# EAGLE schematic controller_rev4.2 (EAGLE 9.3.0)

## Sheet 1 of 3: Controller
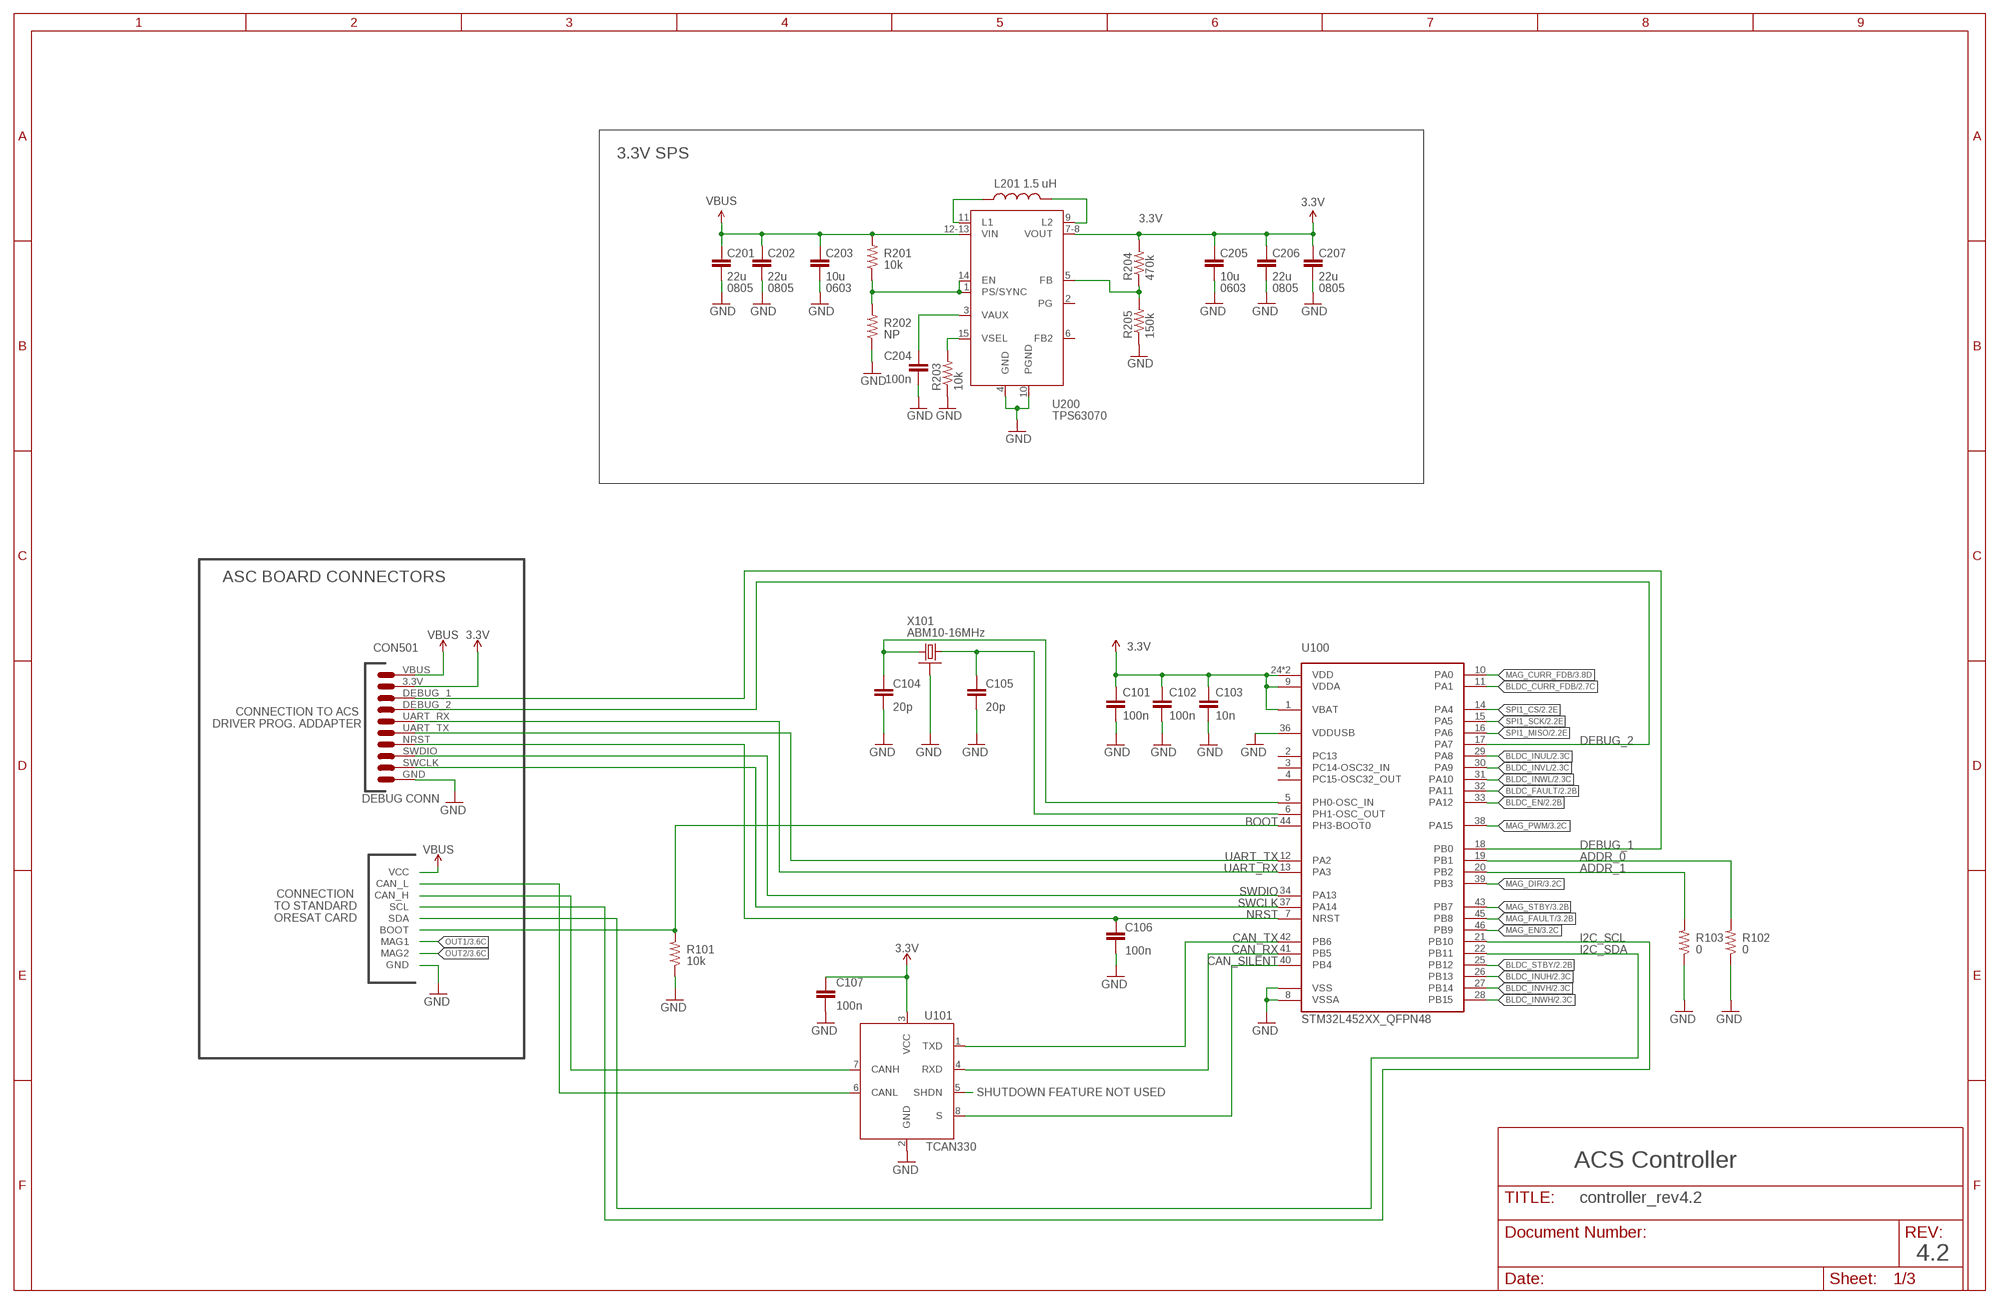
[diagram p0: schematic, sheet 1]

### Parts
C101  100n  C-EU0402-B-NOSILK  [.0402-B-NOSILK]
C102  100n  C-EU0402-B-NOSILK  [.0402-B-NOSILK]
C103  10n  C-EU0402-B-NOSILK  [.0402-B-NOSILK]
C104  20p  C-EU0402-B-NOSILK  [.0402-B-NOSILK]
C105  20p  C-EU0402-B-NOSILK  [.0402-B-NOSILK]
C106  100n  C-EU0402-B-NOSILK  [.0402-B-NOSILK]
C107  100n  C-EU0402-B-NOSILK  [.0402-B-NOSILK]
C201  22u  C-EU0805-B-NOSILK  [.0805-B-NOSILK]
C202  22u  C-EU0805-B-NOSILK  [.0805-B-NOSILK]
C203  10u  C-EU0603-B-NOSILK  [.0603-B-NOSILK]
C204  100n  C-EU0402-B-NOSILK  [.0402-B-NOSILK]
C205  10u  C-EU0603-B-NOSILK  [.0603-B-NOSILK]
C206  22u  C-EU0805-B-NOSILK  [.0805-B-NOSILK]
C207  22u  C-EU0805-B-NOSILK  [.0805-B-NOSILK]
C501  DEBUG_CON  [DEBUG_CON]
L201  1.5 uH  L-COILCRAFT-XFL4020  [L-COILCRAFT-XFL4020]
R101  10k  R-US_0402-B-NOSILK  [.0402-B-NOSILK]
R102  0  R-US_0402-B-NOSILK  [.0402-B-NOSILK]
R103  0  R-US_0402-B-NOSILK  [.0402-B-NOSILK]
R201  10k  R-US_0402-B-NOSILK  [.0402-B-NOSILK]
R202  NP  R-US_0402-B-NOSILK  [.0402-B-NOSILK]
R203  10k  R-US_0402-B-NOSILK  [.0402-B-NOSILK]
R204  470k  R-US_0402-B-NOSILK  [.0402-B-NOSILK]
R205  150k  R-US_0402-B-NOSILK  [.0402-B-NOSILK]
U100  STM32L452XX_QFPN48  [QFPN-48]
U101  TCAN330  [SOT23-8_TI-DCN]
U200  TPS63070  TPS63070X  [TPS63070X]
U$1  DRIVER-FLEX_CONN  [20-PAD_DRIVER-CONN]
X101  ABM10-16MHz  CRYSTAL-WITH-GND  [CRYSTAL_2.5X2]

### Nets
3.3V: C101.1 C102.1 C103.1 C107.1 C205.1 C206.1 C207.1 C501.3.3V R204.2 U100.1(VBAT) U100.9(VDDA) U100.24(VDD) U100.48(VDD) U101.3(VCC) U200.7-8(VOUT) ; also sheet 2,3
ADDR_0: R102.2 U100.19(PB1)
ADDR_1: R103.2 U100.20(PB2)
BLDC_CURR_FDB: U100.11(PA1) ; also sheet 2
BLDC_EN: U100.33(PA12) ; also sheet 2
BLDC_FAULT: U100.32(PA11) ; also sheet 2
BLDC_INUH: U100.26(PB13) ; also sheet 2
BLDC_INUL: U100.29(PA8) ; also sheet 2
BLDC_INVH: U100.27(PB14) ; also sheet 2
BLDC_INVL: U100.30(PA9) ; also sheet 2
BLDC_INWH: U100.28(PB15) ; also sheet 2
BLDC_INWL: U100.31(PA10) ; also sheet 2
BLDC_STBY: U100.25(PB12) ; also sheet 2
BOOT: R101.2 U100.44(PH3-BOOT0) U$1.BOOT
CAN_H: U101.7(CANH) U$1.CAN_H
CAN_L: U101.6(CANL) U$1.CAN_L
CAN_RX: U100.41(PB5) U101.4(RXD)
CAN_SHDN: U101.5(SHDN)
CAN_SILENT: U100.40(PB4) U101.8(S)
CAN_TX: U100.42(PB6) U101.1(TXD)
CLK1: C104.1 U100.5(PH0-OSC_IN) X101.3
CLK2: C105.1 U100.6(PH1-OSC_OUT) X101.1
DEBUG_1: C501.DEBUG_1 U100.18(PB0)
DEBUG_2: C501.DEBUG_2 U100.17(PA7)
GND: C101.2 C102.2 C103.2 C104.2 C105.2 C106.2 C107.2 C201.2 C202.2 C203.2 C204.2 C205.2 C206.2 C207.2 C501.GND R101.1 R102.1 R103.1 R202.1 R203.1 R205.1 U100.8(VSSA) U100.23(VSS) U100.35(VSS) U100.36(VDDUSB) U100.47(VSS) U100.EPAD(VSS) U101.2(GND) U200.4(GND) U200.10(PGND) U$1.GND1(GND) U$1.GND2(GND) U$1.GND3(GND) U$1.GND4(GND) U$1.GND5(GND) U$1.GND6(GND) U$1.GND7(GND) U$1.GND8(GND) U$1.GND9(GND) X101.2(SHIELD) X101.4(SHIELD) ; also sheet 2,3
I2C_SCL: U100.21(PB10) U$1.SCL
I2C_SDA: U100.22(PB11) U$1.SDA
MAG_CURR_FDB: U100.10(PA0) ; also sheet 3
MAG_DIR: U100.39(PB3) ; also sheet 3
MAG_EN: U100.46(PB9) ; also sheet 3
MAG_FAULT: U100.45(PB8) ; also sheet 3
MAG_PWM: U100.38(PA15) ; also sheet 3
MAG_STBY: U100.43(PB7) ; also sheet 3
NRST: C106.1 C501.NRST U100.7(NRST)
OUT1: U$1.MAG1 ; also sheet 3
OUT2: U$1.MAG2 ; also sheet 3
SPI1_CS: U100.14(PA4) ; also sheet 2
SPI1_MISO: U100.16(PA6) ; also sheet 2
SPI1_SCK: U100.15(PA5) ; also sheet 2
SWCLK: C501.SWCLK U100.37(PA14)
SWDIO: C501.SWDIO U100.34(PA13)
TPS-EN2: R201.1 R202.2 U200.1(PS/SYNC) U200.14(EN)
TPS-FB2: R204.1 R205.2 U200.5(FB)
TPS-L5: L201.1 U200.11(L1)
TPS-L6: L201.2 U200.9(L2)
TPS-VAUX2: C204.1 U200.3(VAUX)
TPS-VSEL2: R203.2 U200.15(VSEL)
UART_RX: C501.UART_RX U100.13(PA3)
UART_TX: C501.UART_TX U100.12(PA2)
VBUS: C201.1 C202.1 C203.1 C501.VBUS R201.2 U200.12-13(VIN) U$1.VCC1(VCC) U$1.VCC2(VCC) U$1.VCC3(VCC) U$1.VCC4(VCC) ; also sheet 2,3
Unconnected: U100.2(PC13) U100.3(PC14-OSC32_IN) U100.4(PC15-OSC32_OUT) U200.2(PG) U200.6(FB2)

### Notes on the sheet
- 3.3V SPS
- 0805 | 0805 | 0603 | 0603 | 0805 | 0805
- ASC BOARD CONNECTORS
- CON501
- CONNECTION TO ACS 
  DRIVER PROG. ADDAPTER
- DEBUG CONN
- CONNECTION 
  TO STANDARD
  ORESAT CARD
- SHUTDOWN FEATURE NOT USED
- ACS Controller
- 4.2

## Sheet 2 of 3: Reaction Wheel
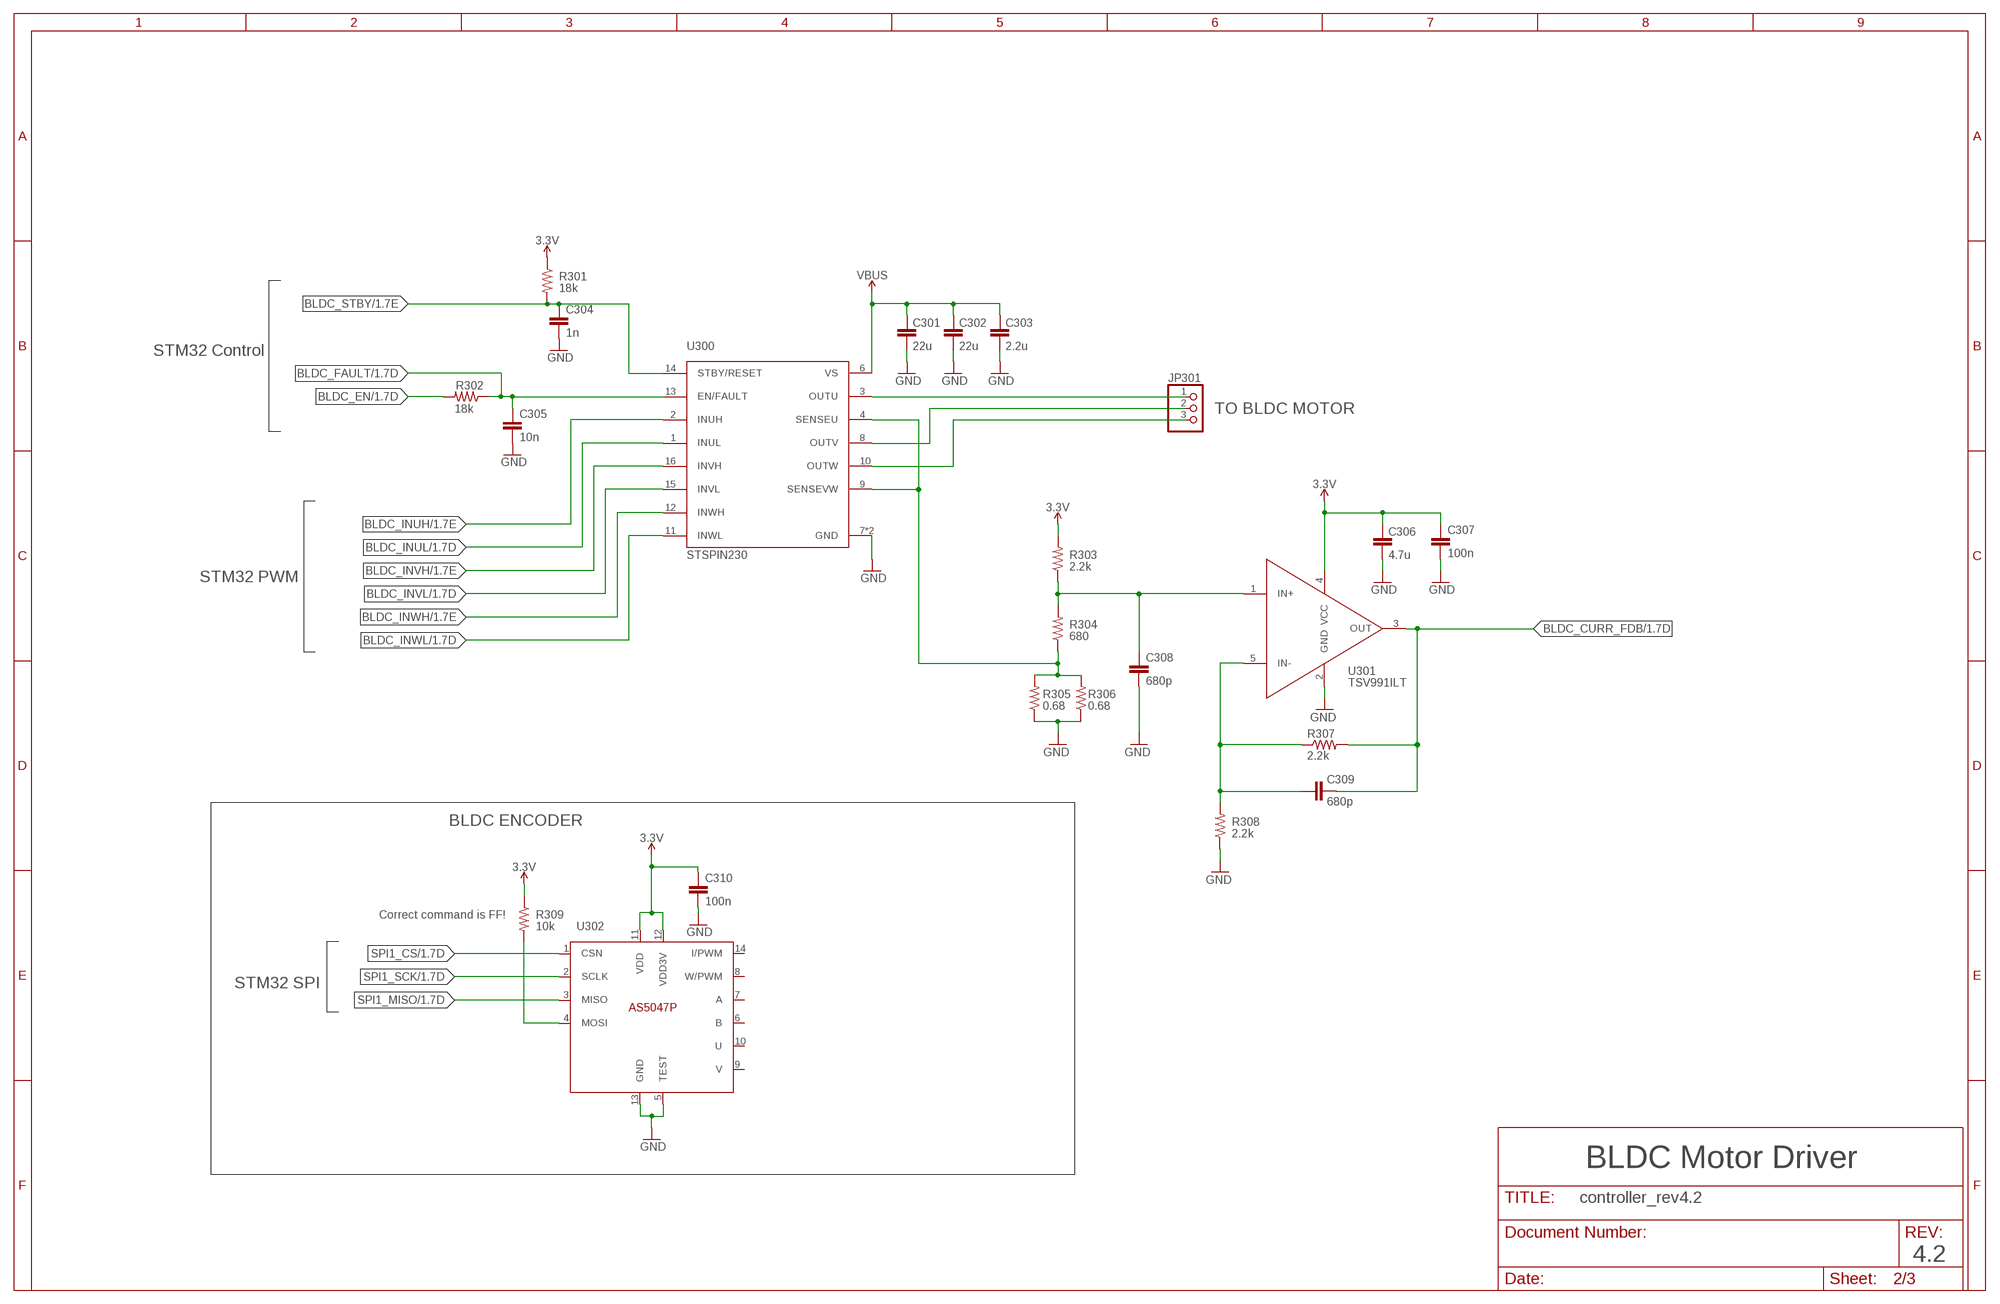
[diagram p1: schematic, sheet 2]

### Parts
C301  22u  C-EU0603-B-NOSILK  [.0603-B-NOSILK]
C302  22u  C-EU0603-B-NOSILK  [.0603-B-NOSILK]
C303  2.2u  C-EU0603-B-NOSILK  [.0603-B-NOSILK]
C304  1n  C-EU0402-B-NOSILK  [.0402-B-NOSILK]
C305  10n  C-EU0402-B-NOSILK  [.0402-B-NOSILK]
C306  4.7u  C-EU0603-B-NOSILK  [.0603-B-NOSILK]
C307  100n  C-EU0402-B-NOSILK  [.0402-B-NOSILK]
C308  680p  C-EU0402-B-NOSILK  [.0402-B-NOSILK]
C309  680p  C-EU0402-B-NOSILK  [.0402-B-NOSILK]
C310  100n  C-EU0402-B-NOSILK  [.0402-B-NOSILK]
JP301  PINHD-1X03_2.00  [1X03M]
R301  18k  R-US_0402-B-NOSILK  [.0402-B-NOSILK]
R302  18k  R-US_0402-B-NOSILK  [.0402-B-NOSILK]
R303  2.2k  R-US_0402-B-NOSILK  [.0402-B-NOSILK]
R304  680  R-US_0402-B-NOSILK  [.0402-B-NOSILK]
R305  0.68  R-US_0805-B-NOSILK  [.0805-B-NOSILK]
R306  0.68  R-US_0805-B-NOSILK  [.0805-B-NOSILK]
R307  2.2k  R-US_0402-B-NOSILK  [.0402-B-NOSILK]
R308  2.2k  R-US_0402-B-NOSILK  [.0402-B-NOSILK]
R309  10k  R-US_0402-B-NOSILK  [.0402-B-NOSILK]
U300  STSPIN230  [VFQPN]
U301  TSV991ILT  [SOT23-5]
U302  AS5047P  [TSSOP14]

### Nets
3.3V: C306.1 C307.1 C310.1 R301.1 R303.2 R309.1 U301.4(VCC) U302.11(VDD) U302.12(VDD3V) ; also sheet 1,3
AS5047_MOSI: R309.2 U302.4(MOSI)
B_IN+: C308.1 R303.1 R304.2 U301.1(IN+)
B_IN-: C309.2 R307.1 R308.2 U301.5(IN-)
BLDC_CURR_FDB: C309.1 R307.2 U301.3(OUT) ; also sheet 1
BLDC_EN: R302.2 ; also sheet 1
BLDC_FAULT: C305.1 R302.1 U300.13(EN/FAULT) ; also sheet 1
BLDC_INUH: U300.2(INUH) ; also sheet 1
BLDC_INUL: U300.1(INUL) ; also sheet 1
BLDC_INVH: U300.16(INVH) ; also sheet 1
BLDC_INVL: U300.15(INVL) ; also sheet 1
BLDC_INWH: U300.12(INWH) ; also sheet 1
BLDC_INWL: U300.11(INWL) ; also sheet 1
BLDC_STBY: C304.1 R301.2 U300.14(STBY/RESET) ; also sheet 1
GND: C301.2 C302.2 C303.2 C304.2 C305.2 C306.2 C307.2 C308.2 C310.2 R305.1 R306.1 R308.1 U300.7(GND) U300.EPAD(GND) U301.2(GND) U302.5(TEST) U302.13(GND) ; also sheet 1,3
SENSE_BLDC: R304.1 R305.2 R306.2 U300.4(SENSEU) U300.9(SENSEVW)
SPI1_CS: U302.1(CSN) ; also sheet 1
SPI1_MISO: U302.3(MISO) ; also sheet 1
SPI1_SCK: U302.2(SCLK) ; also sheet 1
U: JP301.1 U300.3(OUTU)
V: JP301.2 U300.8(OUTV)
VBUS: C301.1 C302.1 C303.1 U300.6(VS) ; also sheet 1,3
W: JP301.3 U300.10(OUTW)
Unconnected: U302.6(B) U302.7(A) U302.8(W/PWM) U302.9(V) U302.10(U) U302.14(I/PWM)

### Notes on the sheet
- STM32 Control
- TO BLDC MOTOR
- STM32 PWM
- BLDC ENCODER
- Correct command is FF!
- STM32 SPI
- BLDC Motor Driver
- 4.2

## Sheet 3 of 3: Magnetorquer
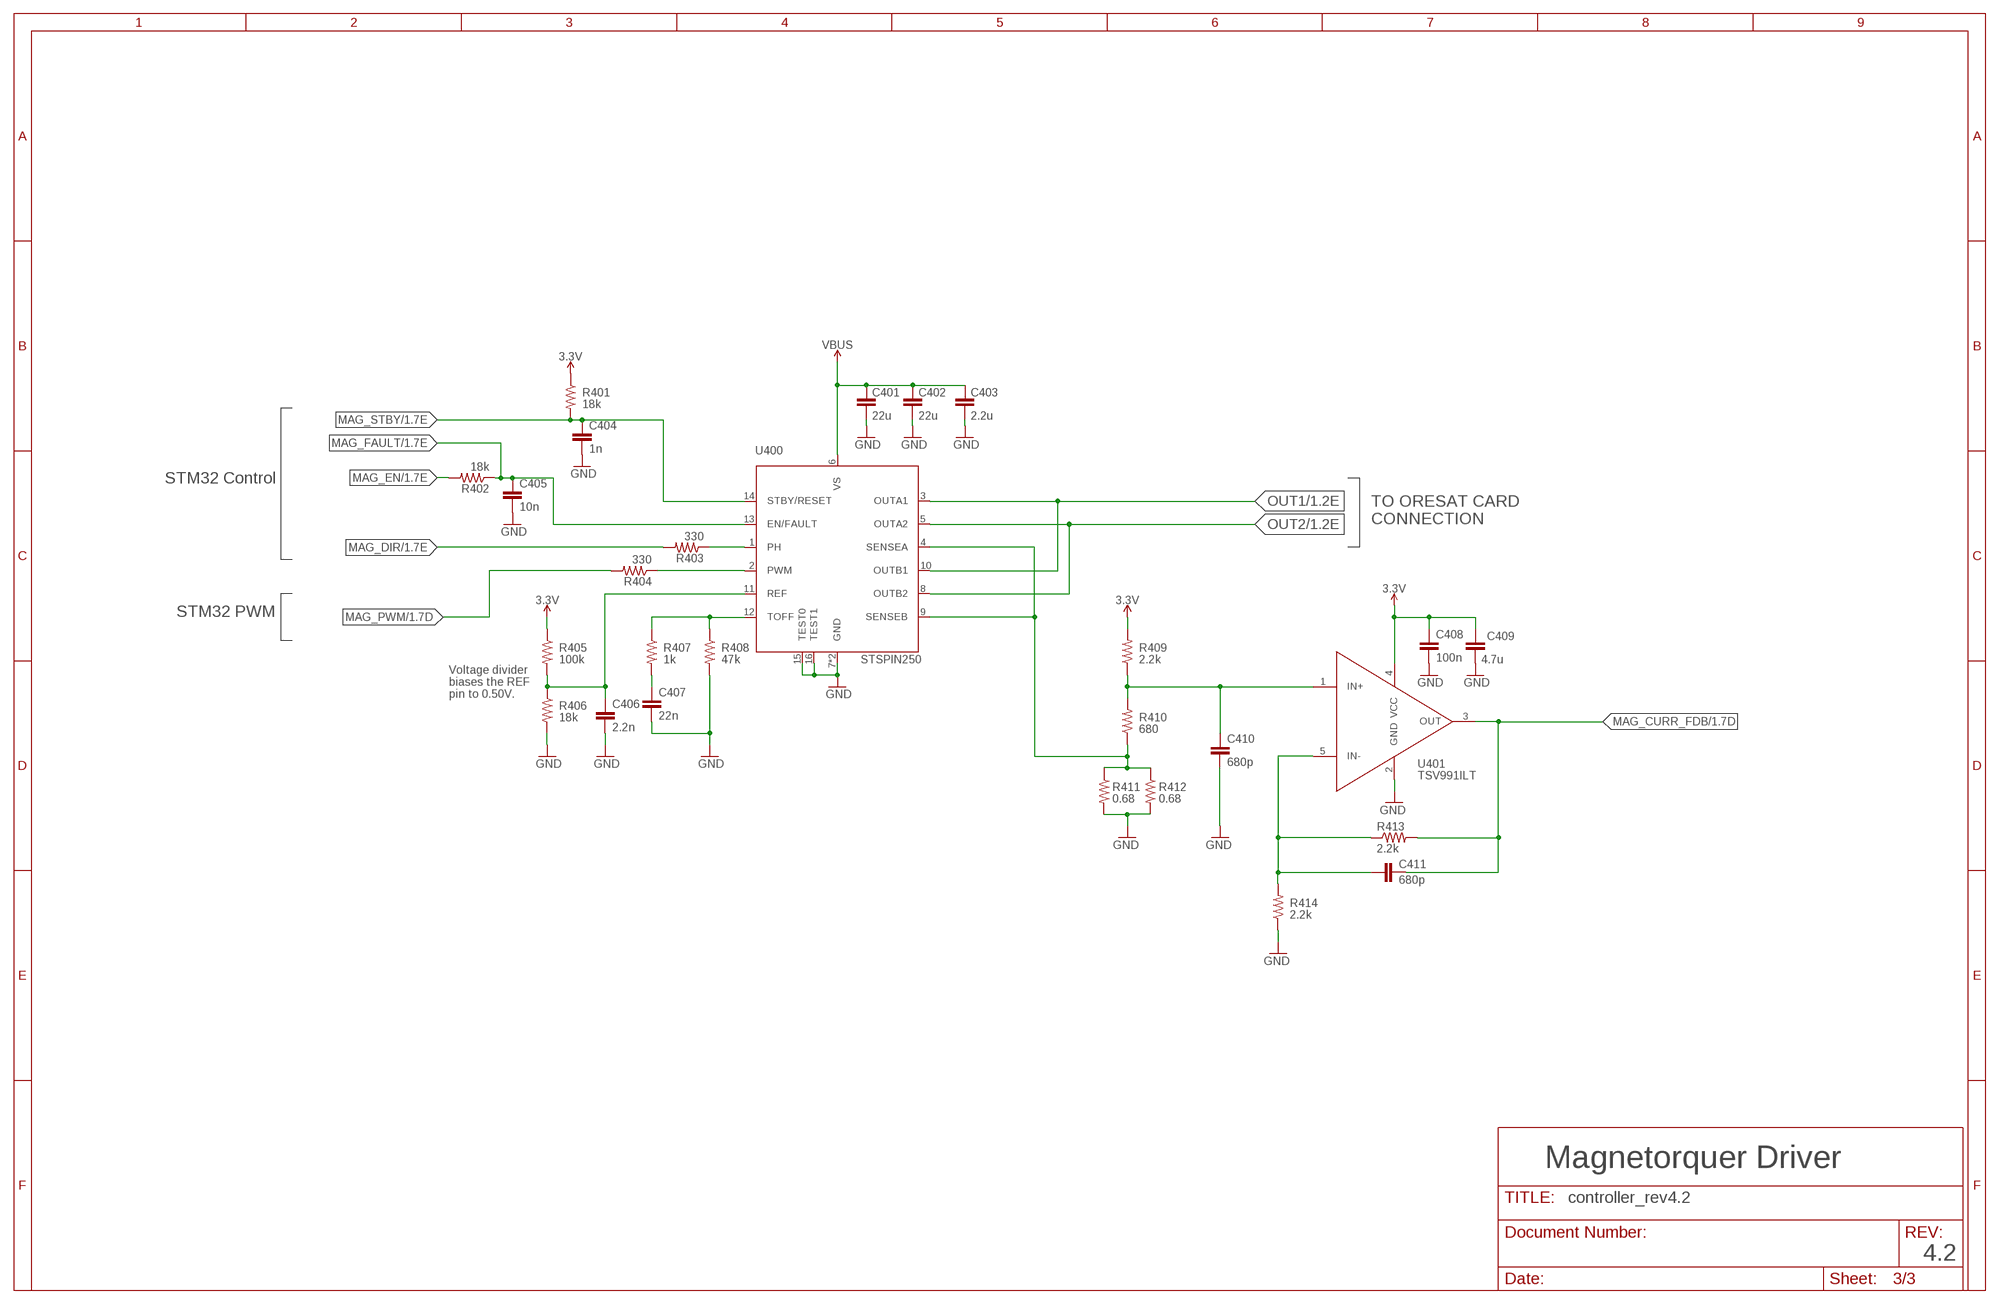
[diagram p2: schematic, sheet 3]

### Parts
C401  22u  C-EU0603-B-NOSILK  [.0603-B-NOSILK]
C402  22u  C-EU0603-B-NOSILK  [.0603-B-NOSILK]
C403  2.2u  C-EU0603-B-NOSILK  [.0603-B-NOSILK]
C404  1n  C-EU0402-B-NOSILK  [.0402-B-NOSILK]
C405  10n  C-EU0402-B-NOSILK  [.0402-B-NOSILK]
C406  2.2n  C-EU0402-B-NOSILK  [.0402-B-NOSILK]
C407  22n  C-EU0402-B-NOSILK  [.0402-B-NOSILK]
C408  100n  C-EU0402-B-NOSILK  [.0402-B-NOSILK]
C409  4.7u  C-EU0603-B-NOSILK  [.0603-B-NOSILK]
C410  680p  C-EU0402-B-NOSILK  [.0402-B-NOSILK]
C411  680p  C-EU0402-B-NOSILK  [.0402-B-NOSILK]
R401  18k  R-US_0402-B-NOSILK  [.0402-B-NOSILK]
R402  18k  R-US_0402-B-NOSILK  [.0402-B-NOSILK]
R403  330  R-US_0402-B-NOSILK  [.0402-B-NOSILK]
R404  330  R-US_0402-B-NOSILK  [.0402-B-NOSILK]
R405  100k  R-US_0402-B-NOSILK  [.0402-B-NOSILK]
R406  18k  R-US_0402-B-NOSILK  [.0402-B-NOSILK]
R407  1k  R-US_0402-B-NOSILK  [.0402-B-NOSILK]
R408  47k  R-US_0402-B-NOSILK  [.0402-B-NOSILK]
R409  2.2k  R-US_0402-B-NOSILK  [.0402-B-NOSILK]
R410  680  R-US_0402-B-NOSILK  [.0402-B-NOSILK]
R411  0.68  R-US_0805-B-NOSILK  [.0805-B-NOSILK]
R412  0.68  R-US_0805-B-NOSILK  [.0805-B-NOSILK]
R413  2.2k  R-US_0402-B-NOSILK  [.0402-B-NOSILK]
R414  2.2k  R-US_0402-B-NOSILK  [.0402-B-NOSILK]
U400  STSPIN250  [VFQPN]
U401  TSV991ILT  [SOT23-5]

### Nets
3.3V: C408.1 C409.1 R401.1 R405.1 R409.2 U401.4(VCC) ; also sheet 1,2
250_REF: C406.1 R405.2 R406.1 U400.11(REF)
250_TOFF: R407.1 R408.1 U400.12(TOFF)
GND: C401.2 C402.2 C403.2 C404.2 C405.2 C406.2 C407.2 C408.2 C409.2 C410.2 R406.2 R408.2 R411.2 R412.2 R414.1 U400.7(GND) U400.15(TEST0) U400.16(TEST1) U400.EPAD(GND) U401.2(GND) ; also sheet 1,2
M_IN+: C410.1 R409.1 R410.2 U401.1(IN+)
M_IN-: C411.2 R413.1 R414.2 U401.5(IN-)
M_PH: R403.1 U400.1(PH)
M_PWM: R404.1 U400.2(PWM)
MAG_CURR_FDB: C411.1 R413.2 U401.3(OUT) ; also sheet 1
MAG_DIR: R403.2 ; also sheet 1
MAG_EN: R402.2 ; also sheet 1
MAG_FAULT: C405.1 R402.1 U400.13(EN/FAULT) ; also sheet 1
MAG_PWM: R404.2 ; also sheet 1
MAG_STBY: C404.1 R401.2 U400.14(STBY/RESET) ; also sheet 1
OUT1: U400.3(OUTA1) U400.10(OUTB1) ; also sheet 1
OUT2: U400.5(OUTA2) U400.8(OUTB2) ; also sheet 1
SENSE_MAG: R410.1 R411.1 R412.1 U400.4(SENSEA) U400.9(SENSEB)
TOFF1: C407.1 R407.2
VBUS: C401.1 C402.1 C403.1 U400.6(VS) ; also sheet 1,2

### Notes on the sheet
- STM32 Control
- TO ORESAT CARD 
  CONNECTION
- STM32 PWM
- Voltage divider
  biases the REF
  pin to 0.50V.
- Magnetorquer Driver
- 4.2

## Library data of the parts
C101-C103 C107 C204 C304 C305 C307-C310 C404-C408 C410 C411 = rcl_custom:C-EU: CAPACITOR, European symbol; DIS: Digi-Key; DPN: 1276-1001-1-ND; MFR: Samsung; MPN: CL05B104KO5NNNC
C104-C106 = rcl_custom:C-EU: CAPACITOR, European symbol; DIS: Digi-Key; DPN: 1276-6601-1-ND; MFR: Samsung; MPN: CL05C200JB51PNC
C201 C202 C206 C207 = oresat-rcl:C-EU: CAPACITOR, European symbol
C203 C205 C301-C303 C306 C401-C403 C409 = oresat-rcl:C-EU: CAPACITOR, European symbol; DIS: Digi-Key; DPN: 1276-1001-1-ND; MFR: Samsung; MPN: CL05B104KO5NNNC
C501 = oresat-ACS_driver_board:DEBUG_CON
JP301 = pinhead-2:PINHD-1X03: PIN HEADER
L201 = L-Coilcraft-XFL4020:L-COILCRAFT-XFL4020; DIS: Mouser; DPN: 994-XFL4020-152MEB; MFR: Coilcraft; MPN: XFL4020-152ME
R101-R103 R201-R205 R301-R304 R307-R309 R401-R410 R413 R414 = rcl_custom:R-US_: RESISTOR, American symbol; DIS: Digi-Key; DPN: 1276-4275-1-ND; MFR: Samsung; MPN: RC1005F6653CS
R305 R306 R411 R412 = oresat-rcl:R-US_: RESISTOR, American symbol
U100 = oresat-ACS_driver_board:STM32L452XX_QFPN48
U101 = TCAN330:TCAN330; DIS: Digi-Key; DPN: 296-44211-1-ND; MFR: Texas Instruments; MPN: TCAN330GDCNT
U200 = ic-pwr-tps63070x:TPS63070X: TPS63070 2-V to 16-V Buck-Boost Converter With 3.6-A Switch Current; DIS: Digi-Key; DPN: 296-44874-1-ND; MFR: TI; MPN: TPS63070
U300 = oresat-ACS_driver_board:STSPIN230
U301 U401 = oresat-ACS_driver_board:TSV991ILT
U302 = U-AMS-AS5047P-encoder:AS5047P
U400 = oresat-ACS_driver_board:STSPIN250
U$1 = oresat-ACS_driver_board:DRIVER-FLEX_CONN
X101 = low-gain-radio:CRYSTAL-WITH-GND; DIS: Digi-Key; DPN: XC2181CT-ND; MFR: ECS Inc.; MPN: ECS-160-10-36Q-ES-TR